# EAGLE schematic specMech - Copy (EAGLE 9.6.2)

## Sheet 1 of 8: Curiosity Nano
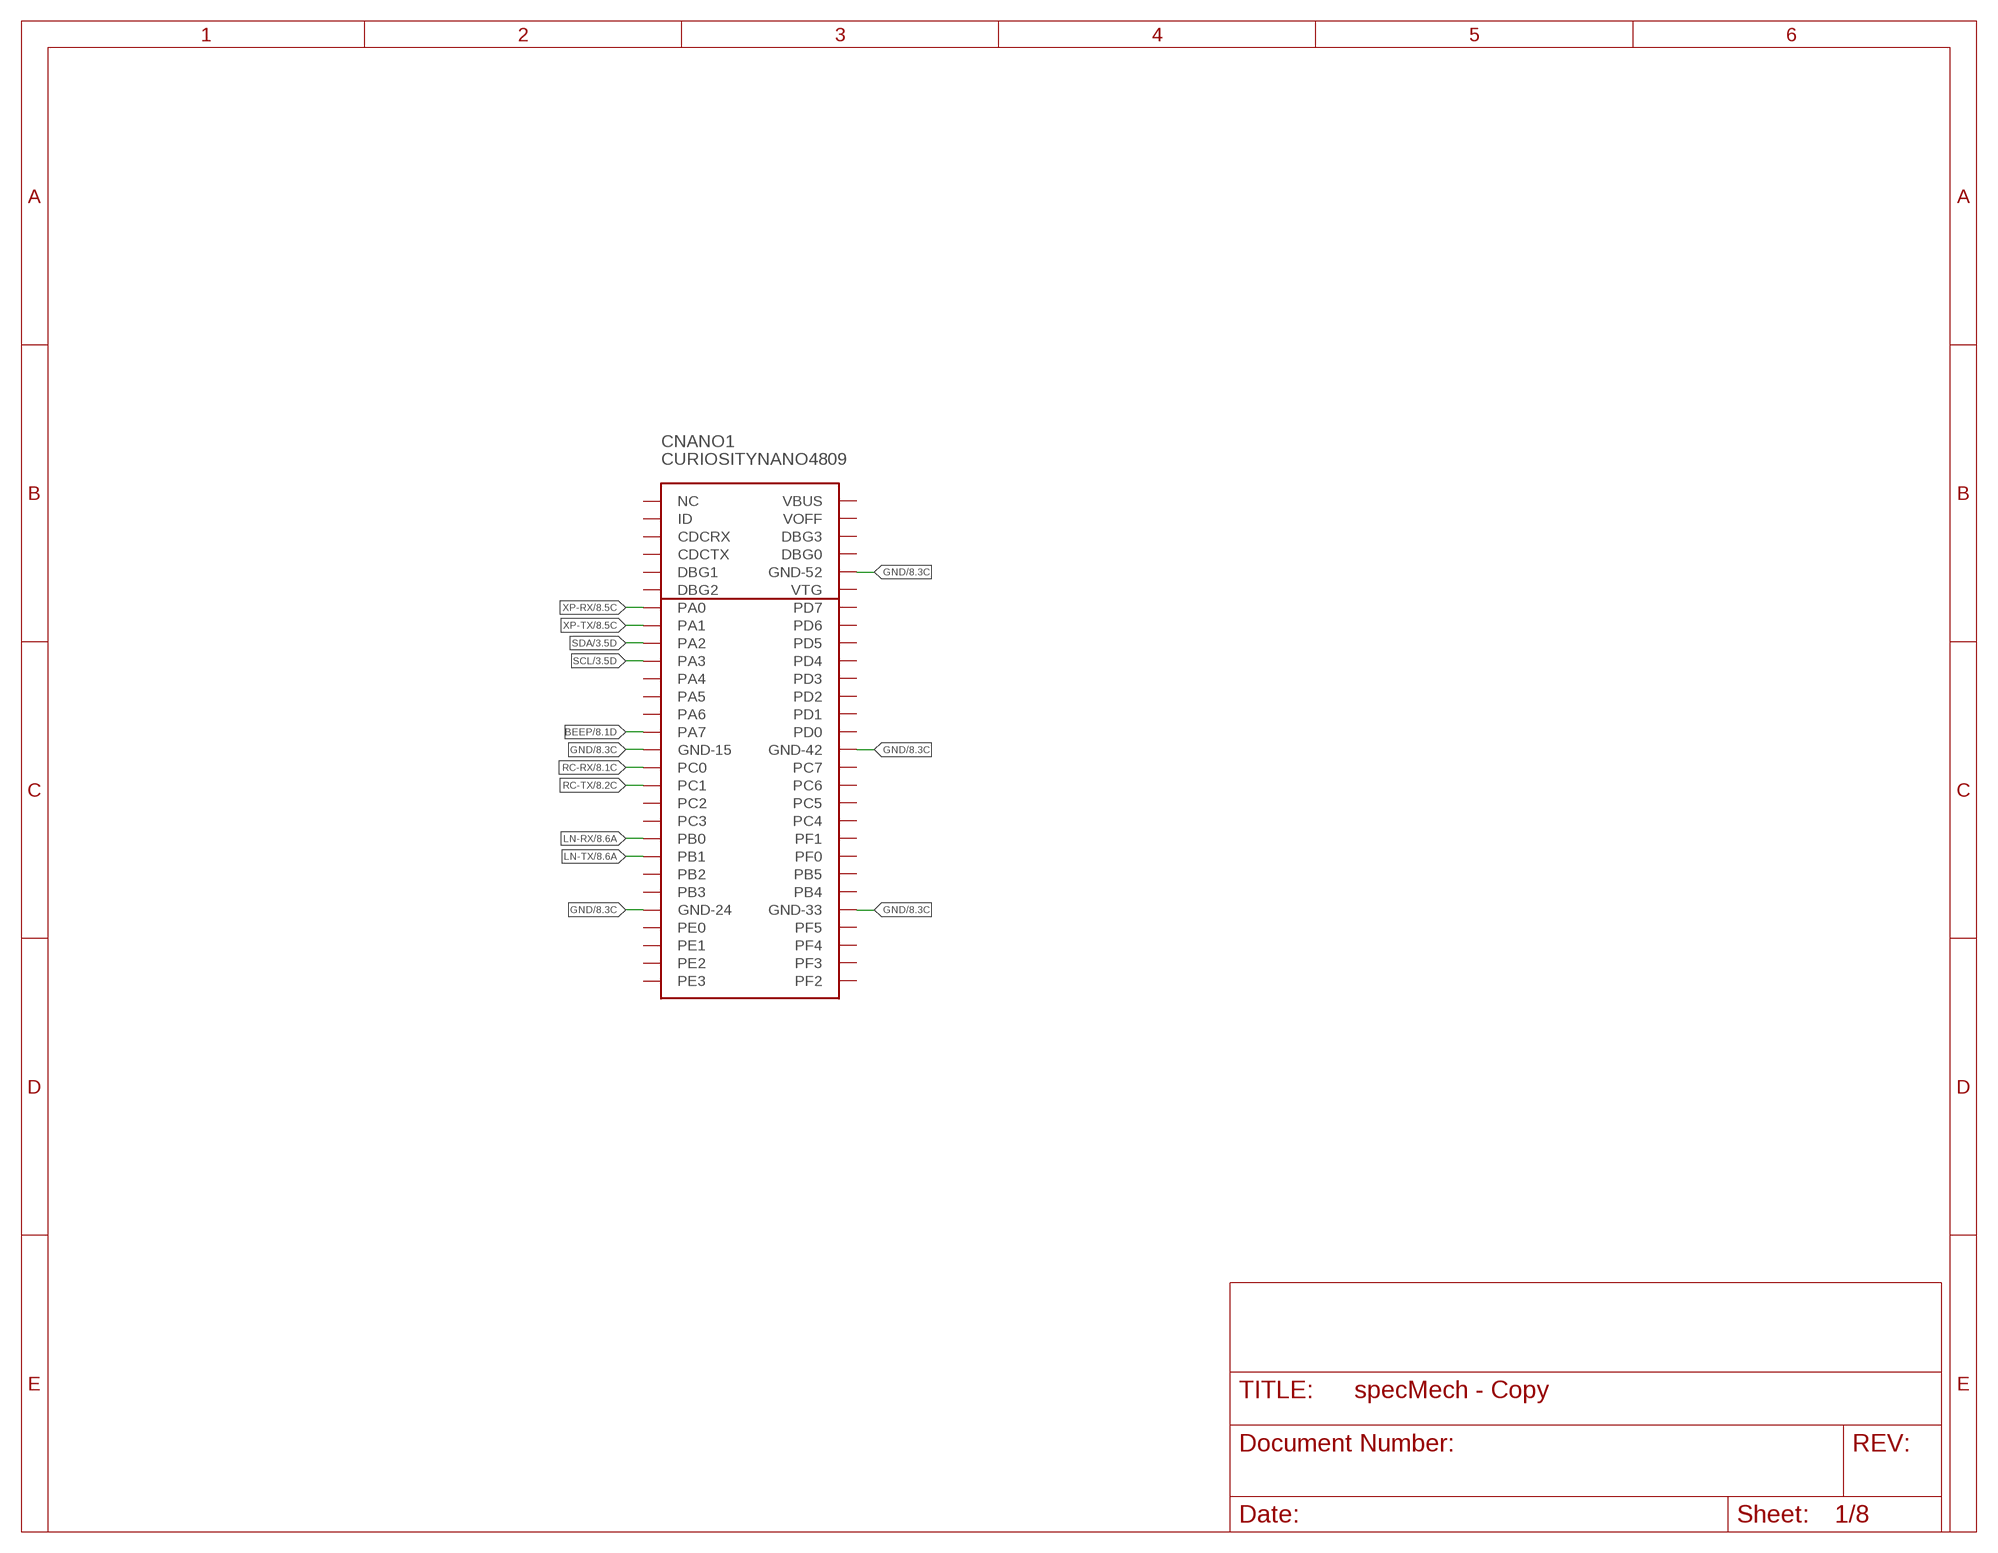
[diagram p0: schematic, sheet 1]

### Parts
CNANO1  CURIOSITYNANO4809  [CURIOSITYNANO4809]

### Nets
BEEP: CNANO1.PA7-SS(PA7) ; also sheet 8
GND: CNANO1.GND15(GND-15) CNANO1.GND24(GND-24) CNANO1.GND33(GND-33) CNANO1.GND42(GND-42) CNANO1.GND52(GND-52) ; also sheet 2,3,4,5,6,7,8
LN-RX: CNANO1.PB0-TX(PB0) ; also sheet 8
LN-TX: CNANO1.PB1-RX(PB1) ; also sheet 8
RC-RX: CNANO1.PC0-TX(PC0) ; also sheet 8
RC-TX: CNANO1.PC1-RX(PC1) ; also sheet 8
SCL: CNANO1.PA3-SCL(PA3) ; also sheet 3,4,5,6,7,8
SDA: CNANO1.PA2-SDA(PA2) ; also sheet 3,4,5,6,7,8
XP-RX: CNANO1.PA0-TX(PA0) ; also sheet 8
XP-TX: CNANO1.PA1-RX(PA1) ; also sheet 8
Unconnected: CNANO1.ID CNANO1.NC CNANO1.PA4-MOSI(PA4) CNANO1.PA5-MISO(PA5) CNANO1.PA6-SCK(PA6) CNANO1.PB0-RX(CDCRX) CNANO1.PB1-TX(CDCTX) CNANO1.PB2 CNANO1.PB3 CNANO1.PB4 CNANO1.PB5 CNANO1.PC2 CNANO1.PC3 CNANO1.PC4 CNANO1.PC5 CNANO1.PC6 CNANO1.PC7 CNANO1.PD0-AIN0(PD0) CNANO1.PD1-AIN1(PD1) CNANO1.PD2-AIN2(PD2) CNANO1.PD3-AIN3(PD3) CNANO1.PD4-AIN4(PD4) CNANO1.PD5-AIN5(PD5) CNANO1.PD6-AIN6(PD6) CNANO1.PD7-AIN7(PD7) CNANO1.PE0 CNANO1.PE1 CNANO1.PE2 CNANO1.PE3 CNANO1.PF0-TOSC1(PF0) CNANO1.PF1-TOSC2(PF1) CNANO1.PF2 CNANO1.PF2-6(DBG2) CNANO1.PF3 CNANO1.PF3-5(DBG1) CNANO1.PF4 CNANO1.PF5-LED(PF5) CNANO1.PF6-SW0(DBG3) CNANO1.UPDI(DBG0) CNANO1.VBUS CNANO1.VOFF CNANO1.VTG

## Sheet 2 of 8: +5V Power
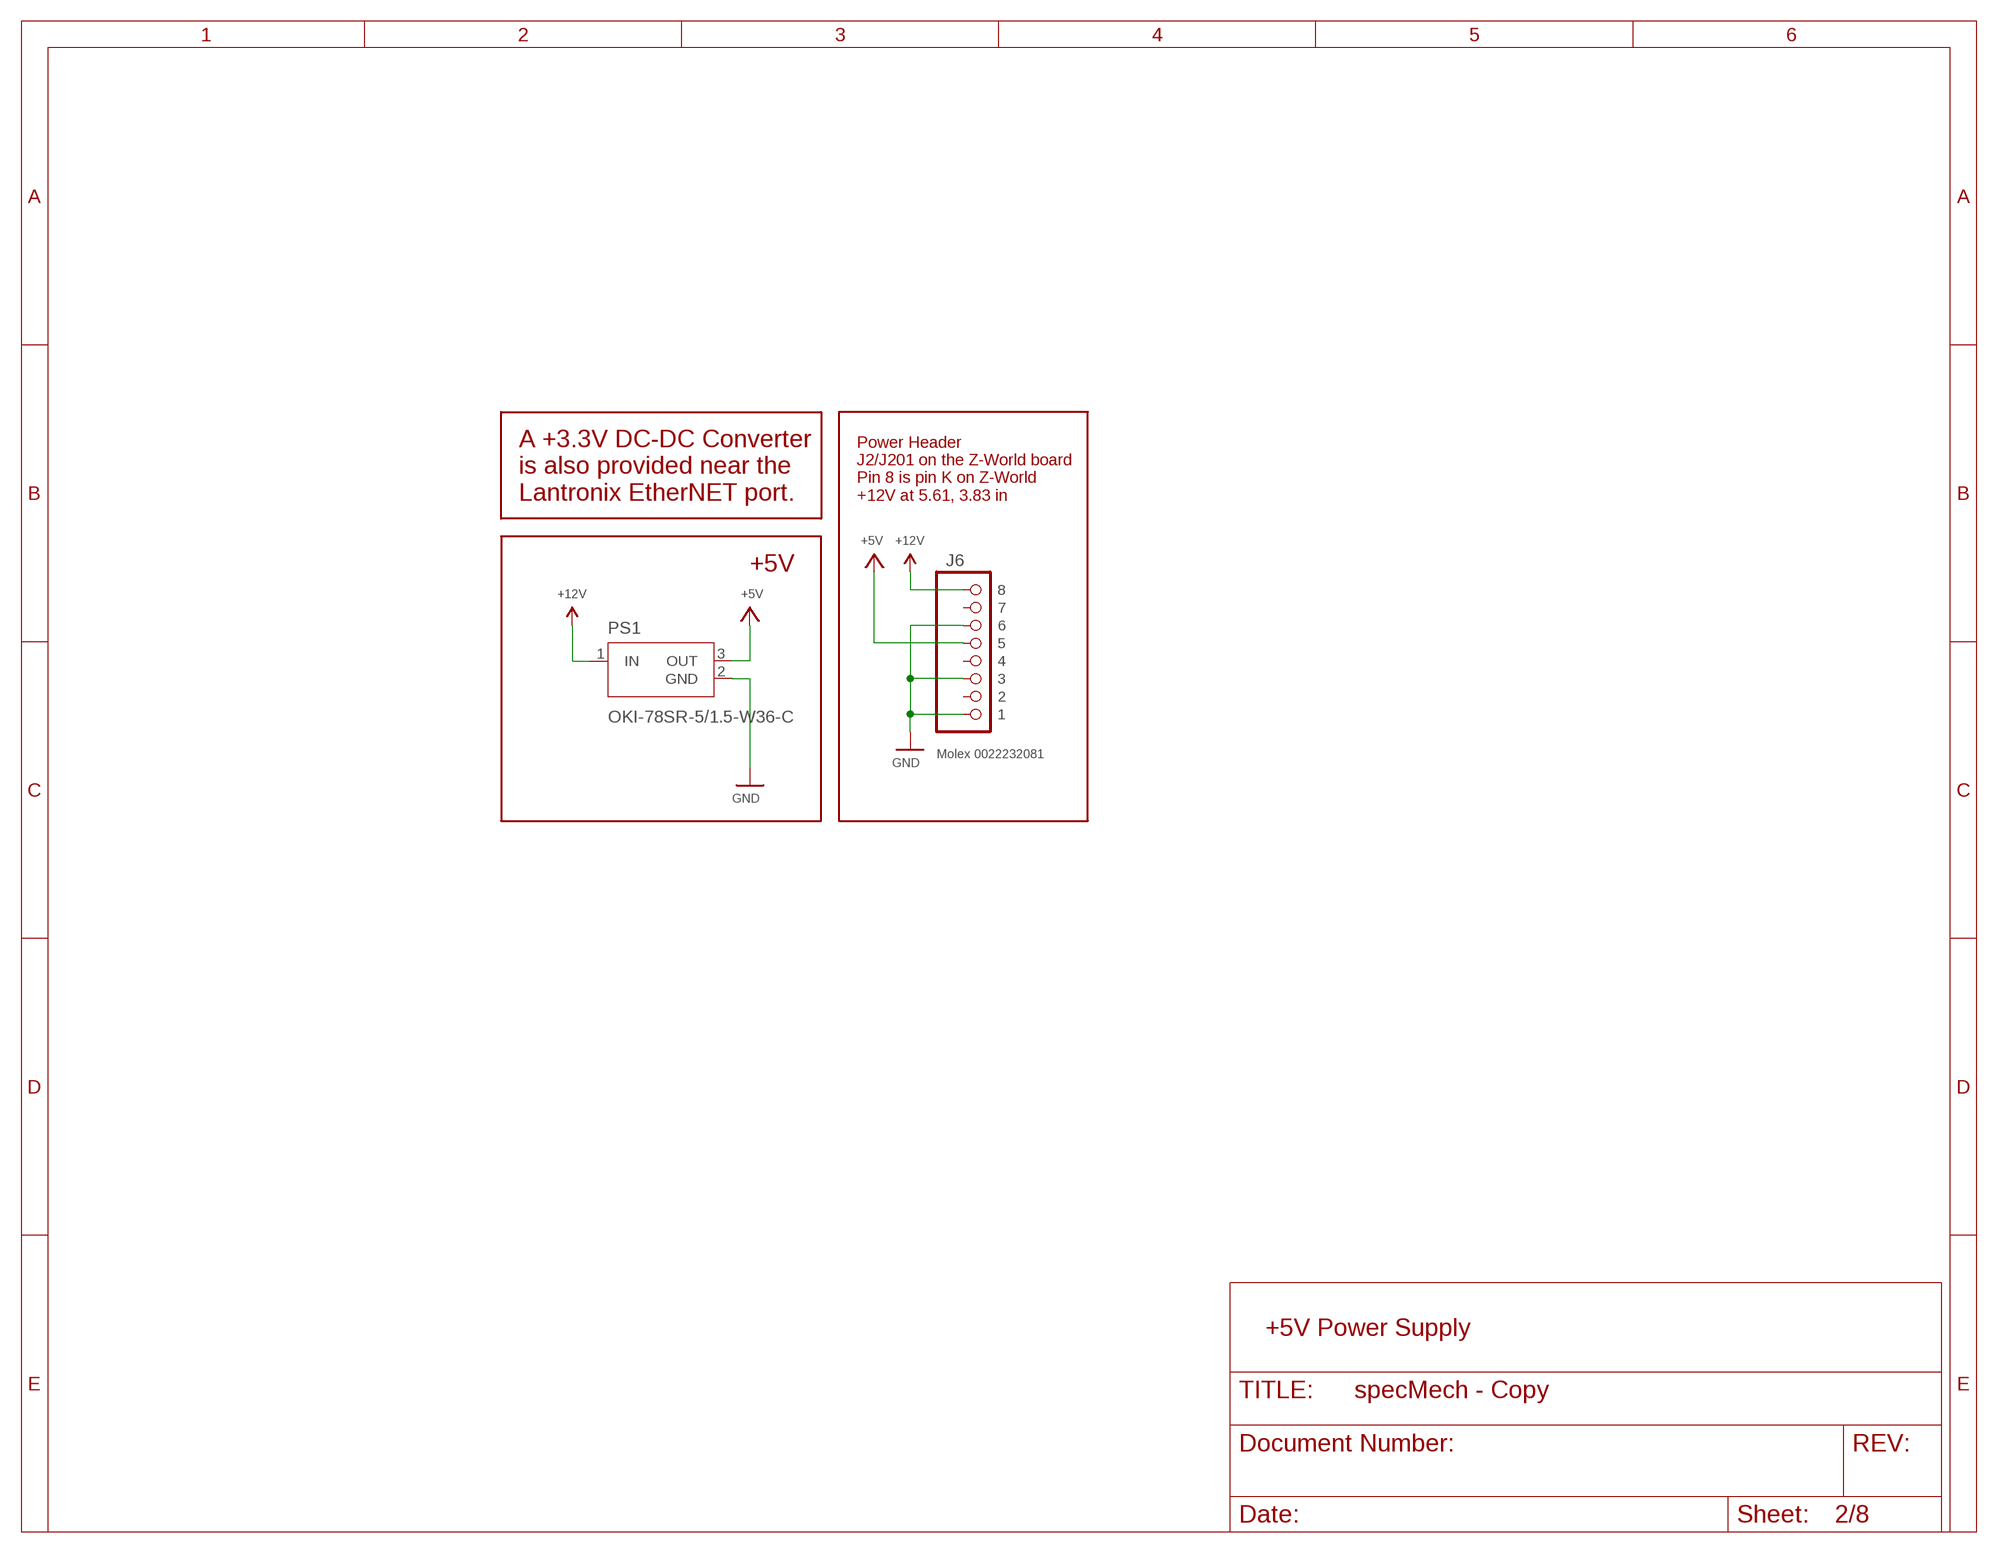
[diagram p1: schematic, sheet 2]

### Parts
J6  Molex 0022232081  PINHD-1X8-MOLEX-SHROUD  [1X08-MOLEX-SHROUD]
PS1  OKI-78SR-5/1.5-W36-C  [CONV_OKI-78SR-5/1.5-W36-C]

### Nets
+5V: J6.P$5 PS1.3(OUT) ; also sheet 3,4,5,6,7,8
+12V: J6.P$8 PS1.1(IN) ; also sheet 5,8
GND: J6.P$1 J6.P$3 J6.P$6 PS1.2(GND) ; also sheet 1,3,4,5,6,7,8
Unconnected: J6.P$2 J6.P$4 J6.P$7

### Notes on the sheet
- A +3.3V DC-DC Converter
  is also provided near the
  Lantronix EtherNET port.
- Power Header
  J2/J201 on the Z-World board
  Pin 8 is pin K on Z-World
  +12V at 5.61, 3.83 in
- +5V
- +5V Power Supply

## Sheet 3 of 8: Miscellaneous peripherals
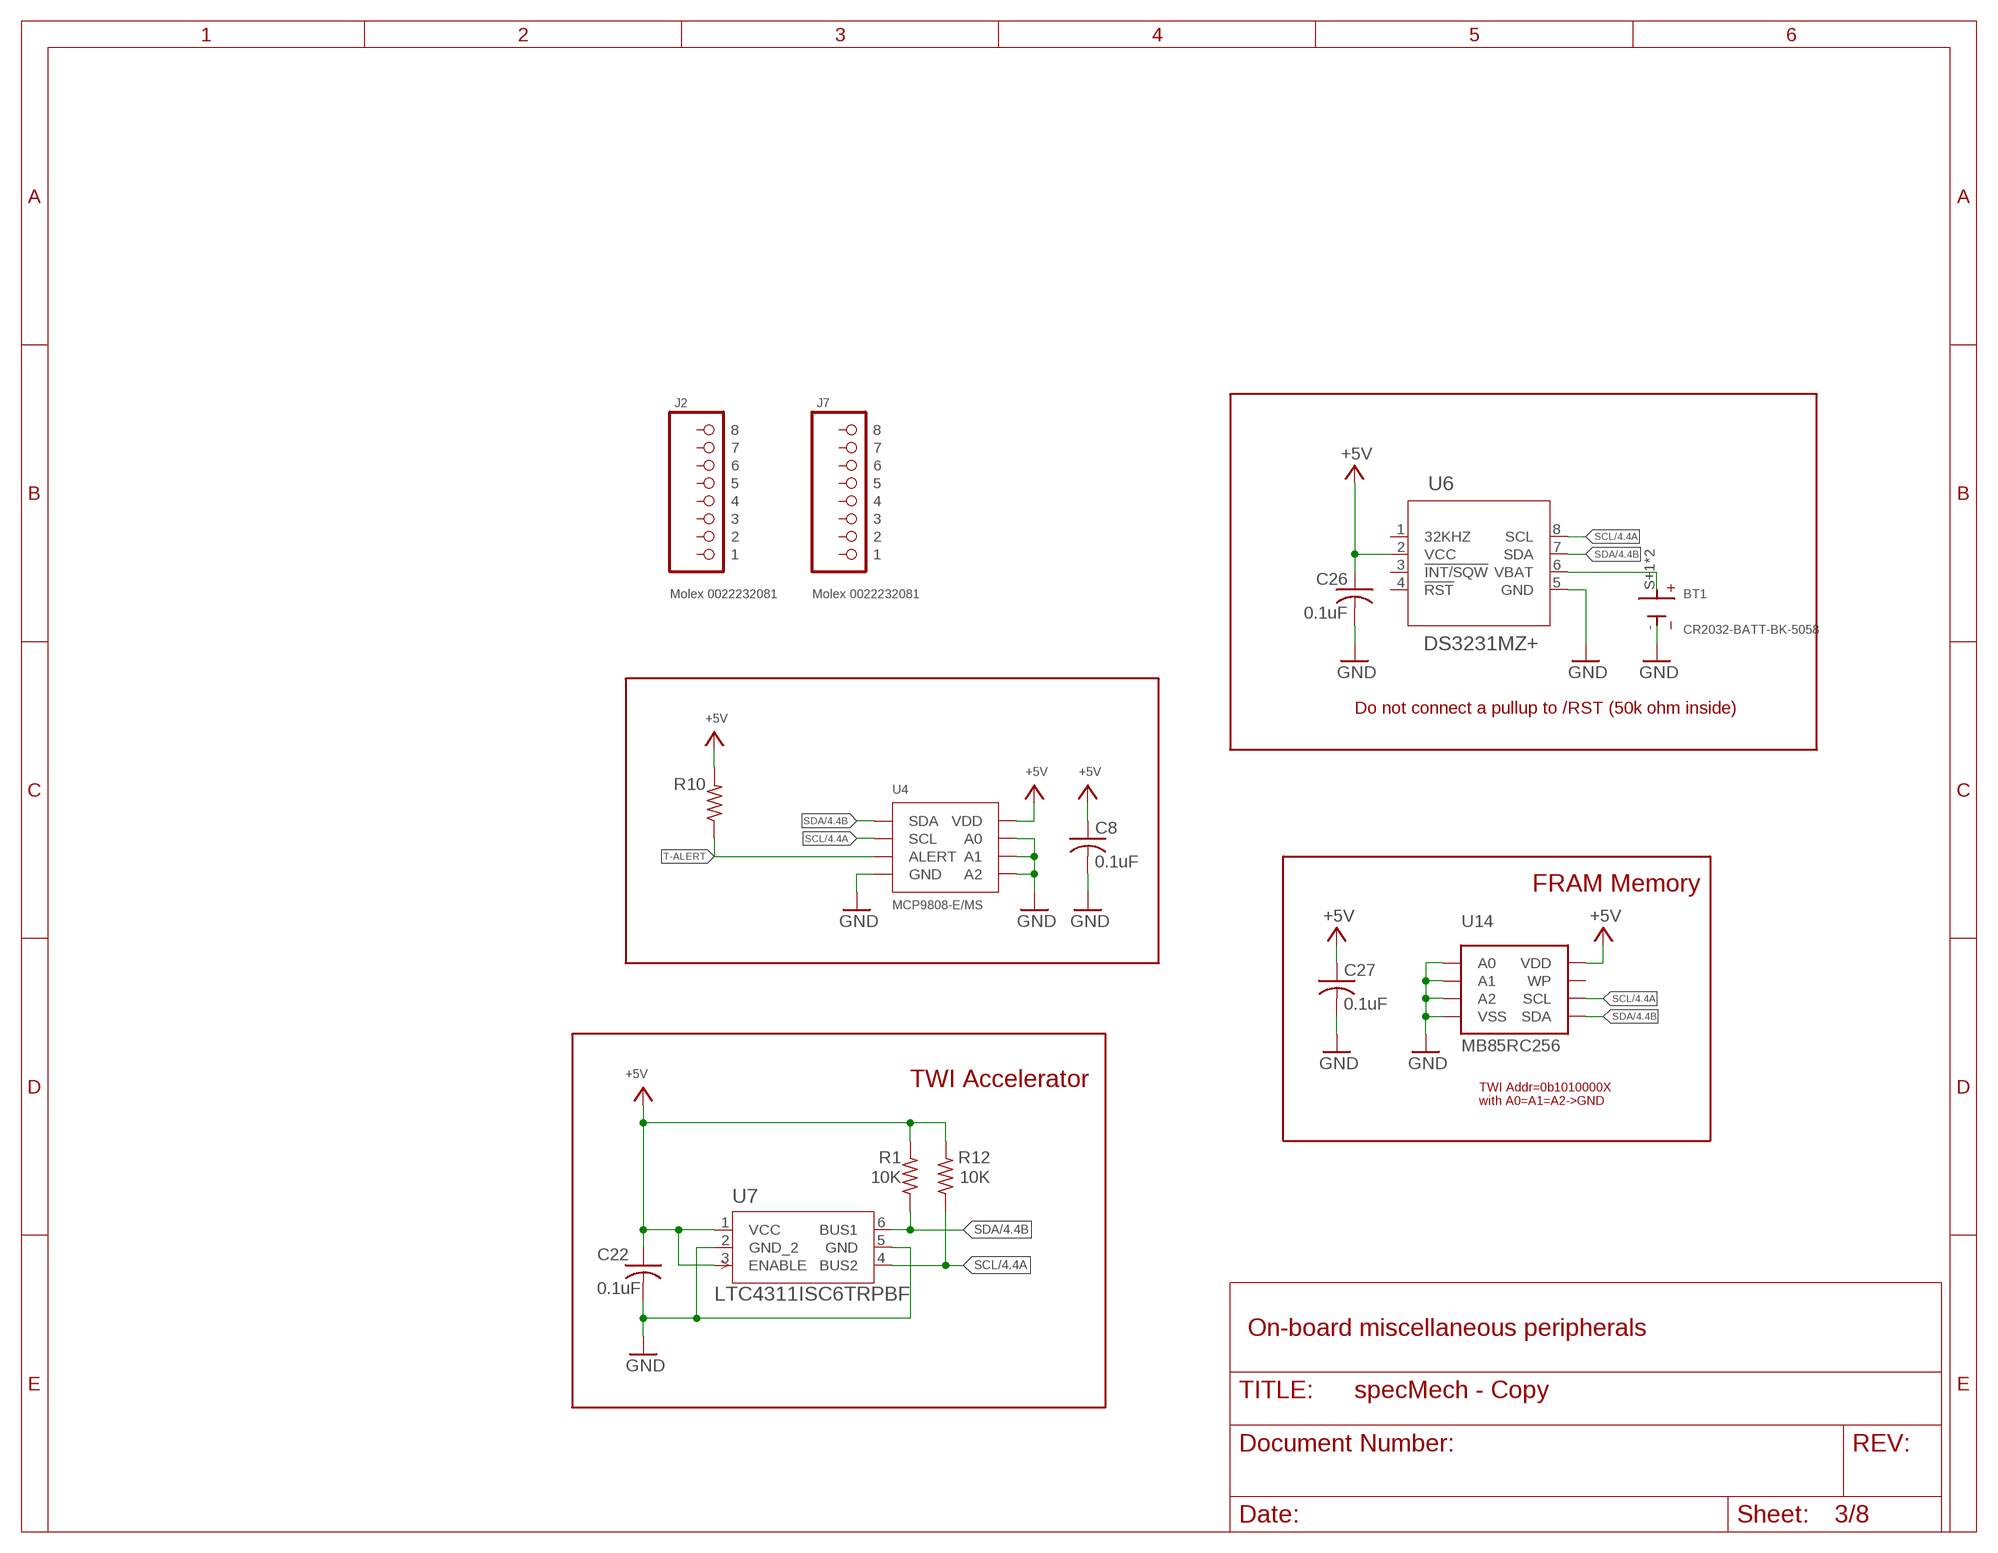
[diagram p2: schematic, sheet 3]

### Parts
BT1  CR2032-BATT-BK-5058  [BAT_BK-5058]
C8  0.1uF  C-USC0805  [C0805]
C22  0.1uF  C-USC0805  [C0805]
C26  0.1uF  C-USC0805  [C0805]
C27  0.1uF  C-USC0805  [C0805]
J2  Molex 0022232081  PINHD-1X8-MOLEX-SHROUD  [1X08-MOLEX-SHROUD]
J7  Molex 0022232081  PINHD-1X8-MOLEX-SHROUD  [1X08-MOLEX-SHROUD]
R1  10K  R-US_R0805  [R0805]
R10  R-US_R0805  [R0805]
R12  10K  R-US_R0805  [R0805]
U4  MCP9808-E/MS  [MSOP8_MC_MCH]
U6  DS3231MZ+  [21-0041B_8]
U7  LTC4311ISC6TRPBF  [SOT-6_SC_LIT]
U14  MB85RC256  MB85RC512  [SOIC127P600X175-8]

### Nets
+5V: C8.1 C22.1 C26.1 C27.1 R1.2 R10.2 R12.2 U4.8(VDD) U6.2(VCC) U7.1(VCC) U7.3(ENABLE) U14.8(VDD) ; also sheet 2,4,5,6,7,8
GND: BT1.- C8.2 C22.2 C26.2 C27.2 U4.4(GND) U4.5(A2) U4.6(A1) U4.7(A0) U6.5(GND) U7.2(GND_2) U7.5(GND) U14.1(A0) U14.2(A1) U14.3(A2) U14.4(VSS) ; also sheet 1,2,4,5,6,7,8
SCL: R12.1 U4.2(SCL) U6.8(SCL) U7.4(BUS2) U14.6(SCL) ; also sheet 1,4,5,6,7,8
SDA: R1.1 U4.1(SDA) U6.7(SDA) U7.6(BUS1) U14.5(SDA) ; also sheet 1,4,5,6,7,8
T-ALERT: R10.1 U4.3(ALERT)
VBAT1: BT1.S+1(+) BT1.S+2(+) U6.6(VBAT)
Unconnected: J2.P$1 J2.P$2 J2.P$3 J2.P$4 J2.P$5 J2.P$6 J2.P$7 J2.P$8 J7.P$1 J7.P$2 J7.P$3 J7.P$4 J7.P$5 J7.P$6 J7.P$7 J7.P$8 U6.1(32KHZ) U6.3(!INT/SQW) U6.4(!RST) U14.7(WP)

### Notes on the sheet
- Do not connect a pullup to /RST (50k ohm inside)
- FRAM Memory
- TWI Accelerator
- TWI Addr=0b1010000X
  with A0=A1=A2->GND
- On-board miscellaneous peripherals

## Sheet 4 of 8: Digital Input Port Expander
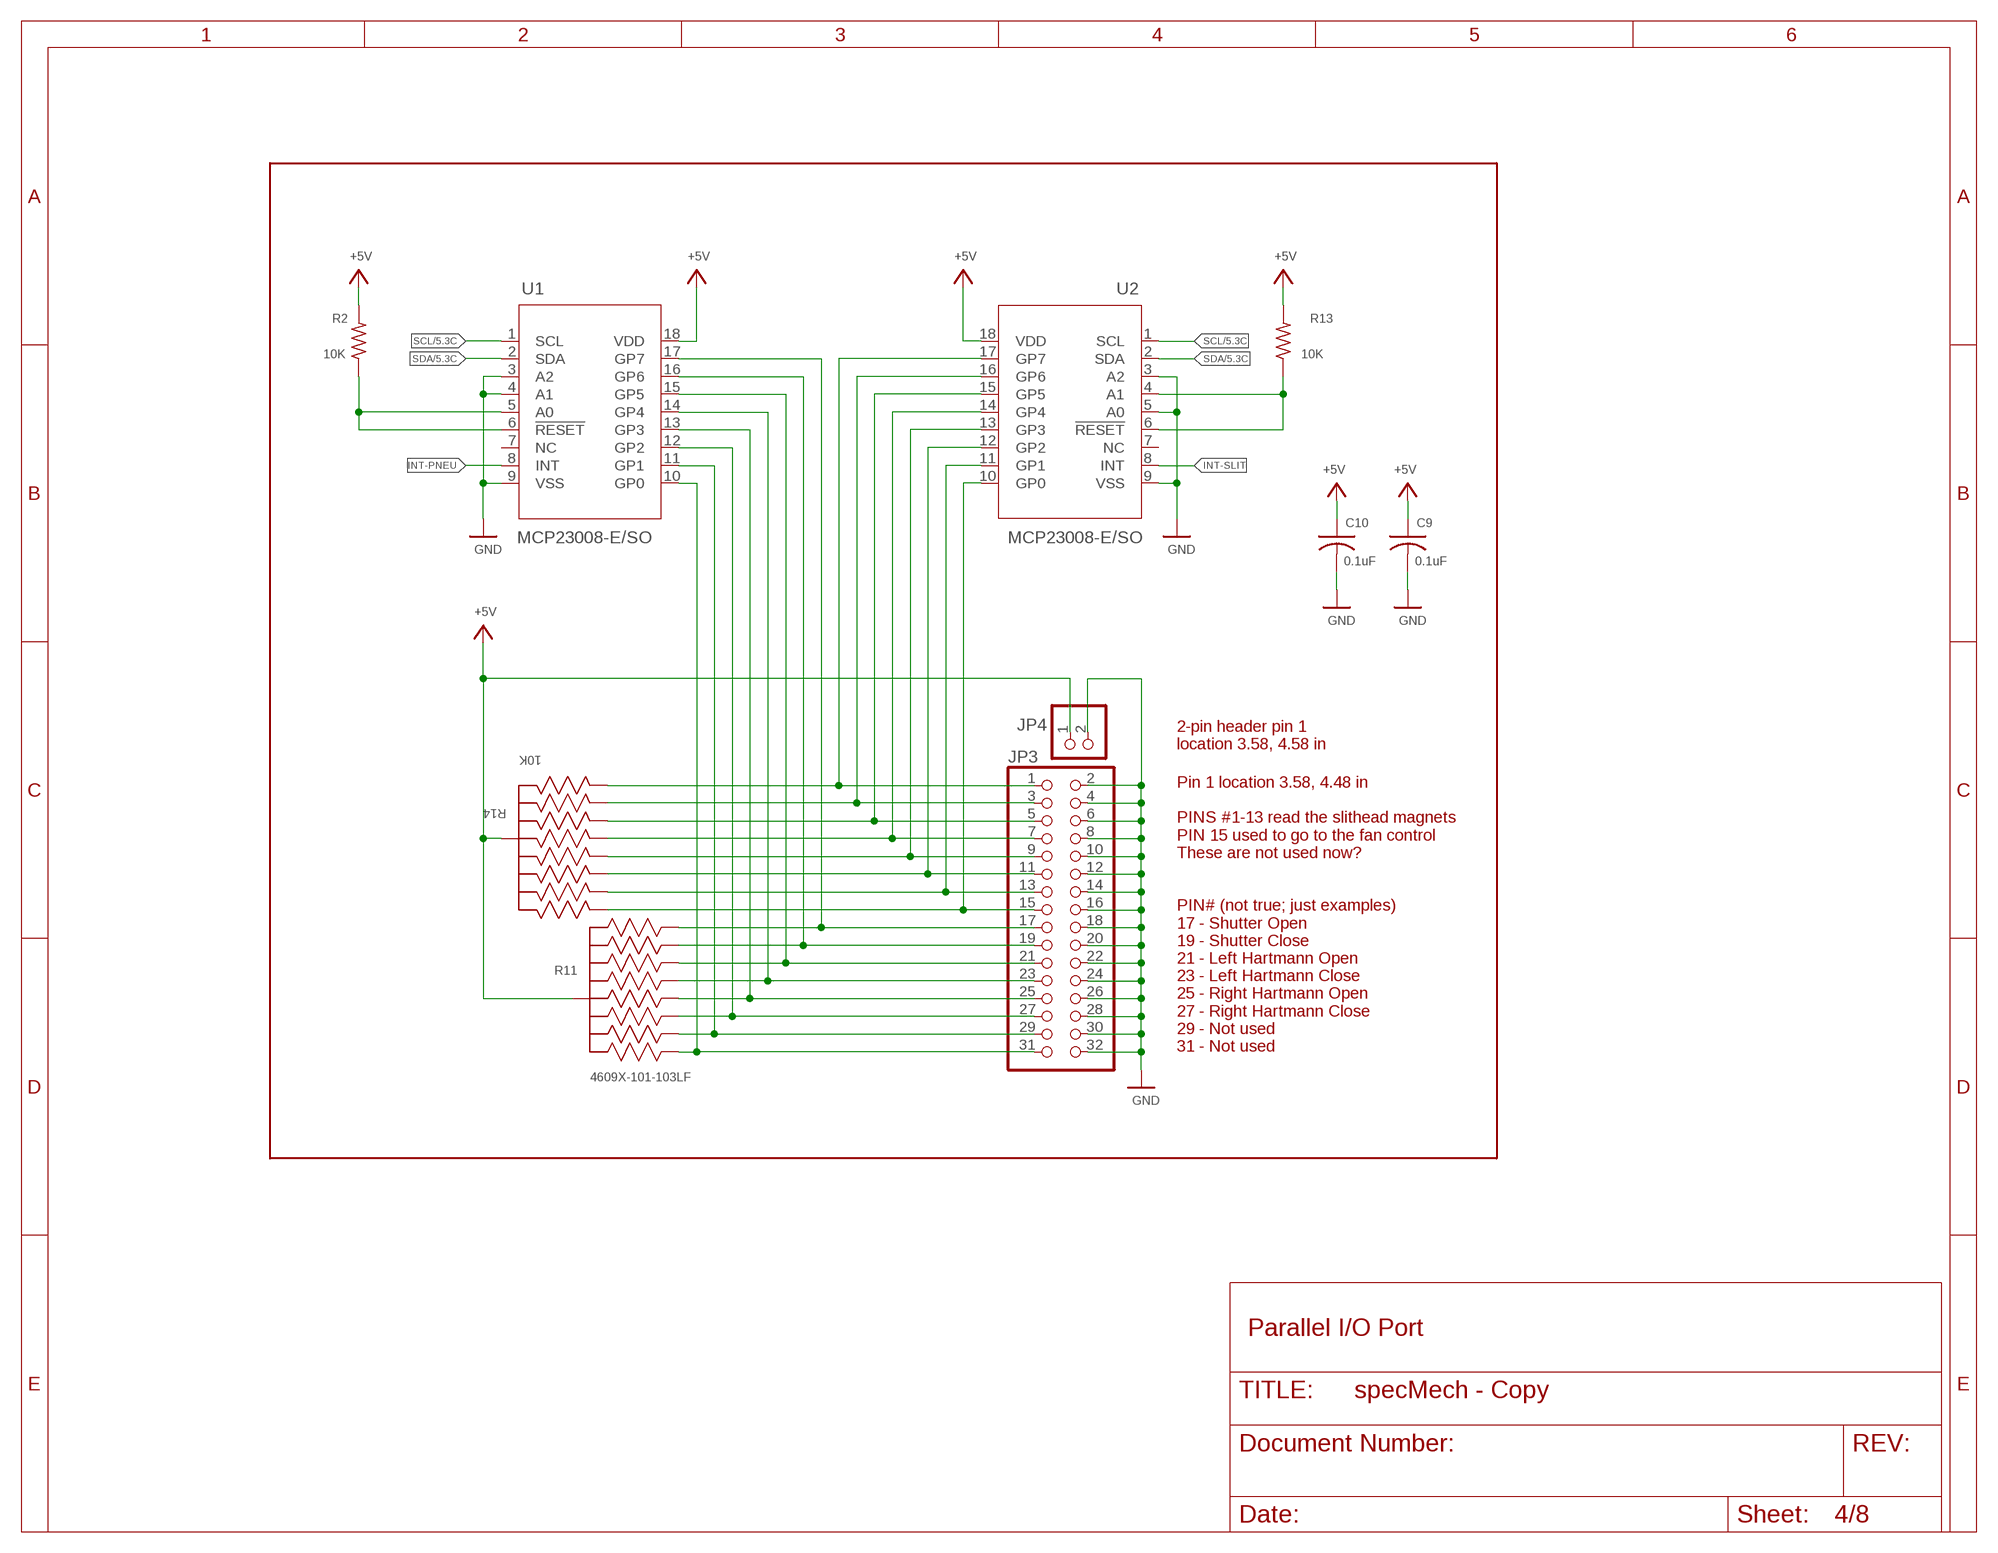
[diagram p3: schematic, sheet 4]

### Parts
C9  0.1uF  C-USC0805  [C0805]
C10  0.1uF  C-USC0805  [C0805]
JP3  PINHD-2X16  [2X16]
JP4  PINHD-1X2  [1X02]
R2  10K  R-US_R0805  [R0805]
R11  4609X-101-103LF  [BO_4609X]
R13  10K  R-US_R0805  [R0805]
R14  10K  4609X-101-103LF  [BO_4609X]
U1  MCP23008-E/SO  [SOIC18-W_MC]
U2  MCP23008-E/SO  [SOIC18-W_MC]

### Nets
+5V: C9.1 C10.1 JP4.1 R2.2 R11.1 R13.2 R14.1 U1.18(VDD) U2.18(VDD) ; also sheet 2,3,5,6,7,8
GND: C9.2 C10.2 JP3.2 JP3.4 JP3.6 JP3.8 JP3.10 JP3.12 JP3.14 JP3.16 JP3.18 JP3.20 JP3.22 JP3.24 JP3.26 JP3.28 JP3.30 JP3.32 JP4.2 U1.3(A2) U1.4(A1) U1.9(VSS) U2.3(A2) U2.5(A0) U2.9(VSS) ; also sheet 1,2,3,5,6,7,8
INT-PNEU: U1.8(INT)
INT-SLIT: U2.8(INT)
N$1: JP3.1 R14.2 U2.17(GP7)
N$2: JP3.3 R14.3 U2.16(GP6)
N$3: JP3.5 R14.4 U2.15(GP5)
N$4: JP3.7 R14.5 U2.14(GP4)
N$9: JP3.17 R11.9 U1.17(GP7)
N$10: JP3.19 R11.8 U1.16(GP6)
N$11: JP3.21 R11.7 U1.15(GP5)
N$12: JP3.23 R11.6 U1.14(GP4)
N$13: JP3.25 R11.5 U1.13(GP3)
N$14: R2.1 U1.5(A0) U1.6(!RESET)
N$15: JP3.29 R11.3 U1.11(GP1)
N$16: JP3.31 R11.2 U1.10(GP0)
N$17: JP3.11 R14.7 U2.12(GP2)
N$20: JP3.27 R11.4 U1.12(GP2)
N$21: JP3.13 R14.8 U2.11(GP1)
N$22: JP3.15 R14.9 U2.10(GP0)
N$24: R13.1 U2.4(A1) U2.6(!RESET)
N$36: JP3.9 R14.6 U2.13(GP3)
SCL: U1.1(SCL) U2.1(SCL) ; also sheet 1,3,5,6,7,8
SDA: U1.2(SDA) U2.2(SDA) ; also sheet 1,3,5,6,7,8
Unconnected: U1.7(NC) U2.7(NC)

### Notes on the sheet
- 2-pin header pin 1
  location 3.58, 4.58 in
- Pin 1 location 3.58, 4.48 in
  
  PINS #1-13 read the slithead magnets
  PIN 15 used to go to the fan control
  These are not used now?
  
  
  PIN# (not true; just examples)
  17 - Shutter Open
  19 - Shutter Close
  21 - Left Hartmann Open
  23 - Left Hartmann Close
  25 - Right Hartmann Open
  27 - Right Hartmann Close
  29 - Not used
  31 - Not used
- Parallel I/O Port

## Sheet 5 of 8: High Current Output
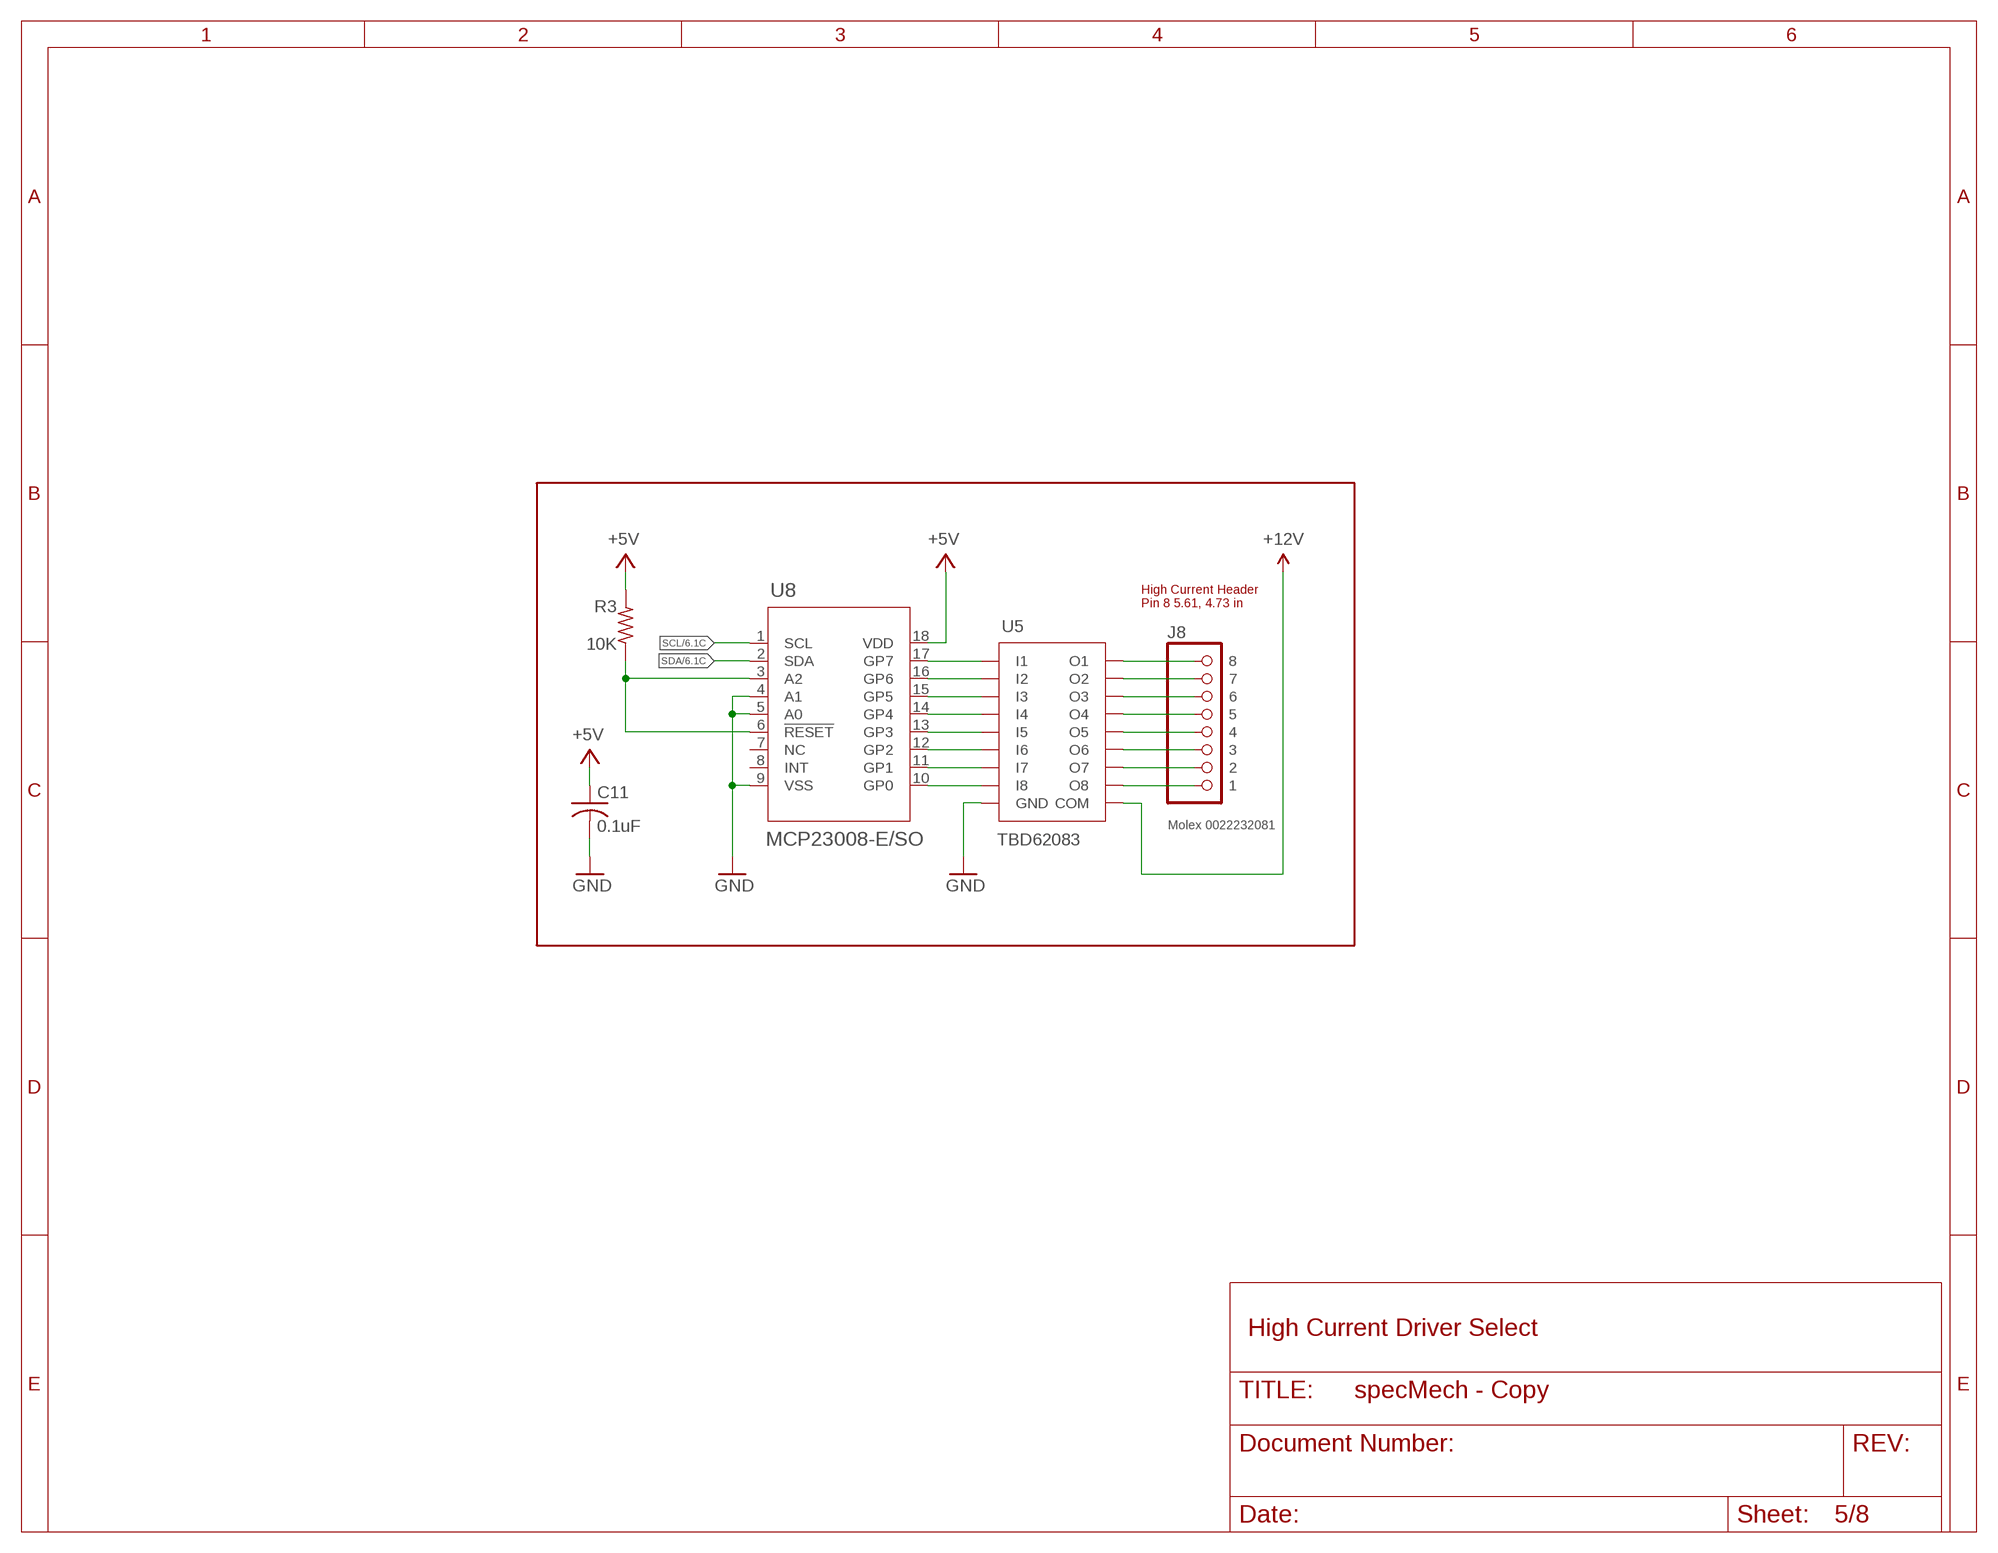
[diagram p4: schematic, sheet 5]

### Parts
C11  0.1uF  C-USC0805  [C0805]
J8  Molex 0022232081  PINHD-1X8-MOLEX-SHROUD  [1X08-MOLEX-SHROUD]
R3  10K  R-US_R0805  [R0805]
U5  TBD62083  TBD62083SOP18-P-375-1.27  [SOIC127P1030X245-18]
U8  MCP23008-E/SO  [SOIC18-W_MC]

### Nets
+5V: C11.1 R3.2 U8.18(VDD) ; also sheet 2,3,4,6,7,8
+12V: U5.10(COM) ; also sheet 2,8
GND: C11.2 U5.9(GND) U8.4(A1) U8.5(A0) U8.9(VSS) ; also sheet 1,2,3,4,6,7,8
N$37: U5.1(I1) U8.17(GP7)
N$38: U5.2(I2) U8.16(GP6)
N$39: U5.3(I3) U8.15(GP5)
N$44: U5.4(I4) U8.14(GP4)
N$45: U5.5(I5) U8.13(GP3)
N$46: U5.6(I6) U8.12(GP2)
N$47: U5.7(I7) U8.11(GP1)
N$48: U5.8(I8) U8.10(GP0)
N$49: R3.1 U8.3(A2) U8.6(!RESET)
N$50: J8.P$8 U5.18(O1)
N$51: J8.P$1 U5.11(O8)
N$52: J8.P$2 U5.12(O7)
N$53: J8.P$3 U5.13(O6)
N$54: J8.P$4 U5.14(O5)
N$55: J8.P$5 U5.15(O4)
N$56: J8.P$6 U5.16(O3)
N$57: J8.P$7 U5.17(O2)
SCL: U8.1(SCL) ; also sheet 1,3,4,6,7,8
SDA: U8.2(SDA) ; also sheet 1,3,4,6,7,8
Unconnected: U8.7(NC) U8.8(INT)

### Notes on the sheet
- High Current Header
  Pin 8 5.61, 4.73 in
- High Current Driver Select

## Sheet 6 of 8: Analog Inputs
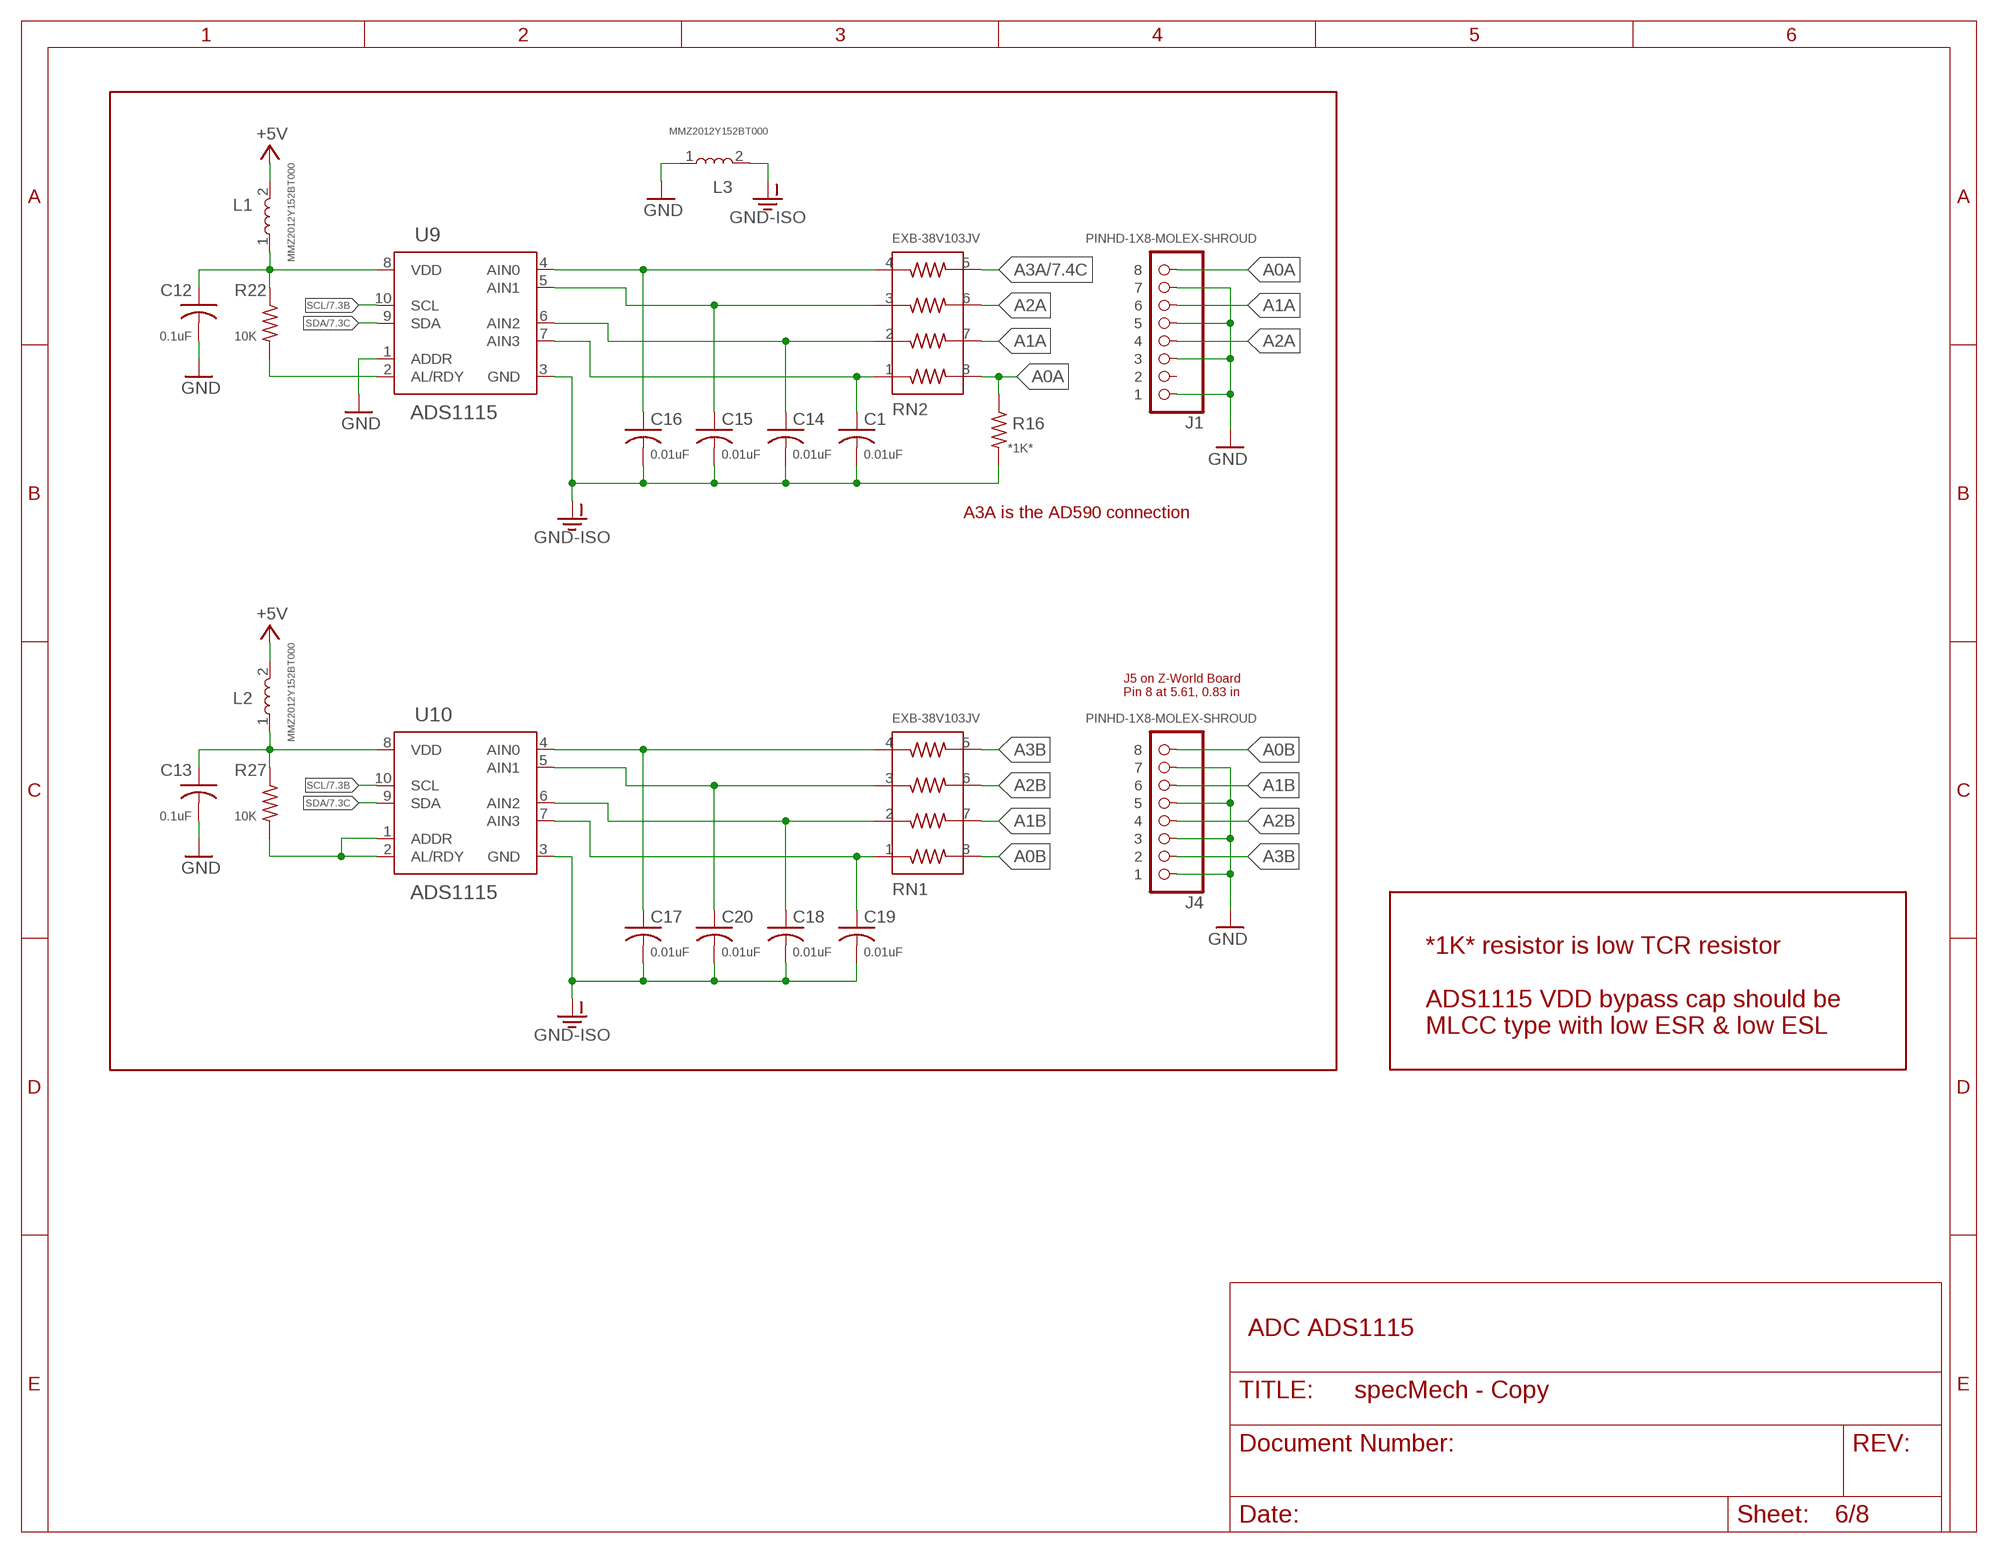
[diagram p5: schematic, sheet 6]

### Parts
C1  0.01uF  C-USC0805  [C0805]
C12  0.1uF  C-USC0805  [C0805]
C13  0.1uF  C-USC0805  [C0805]
C14  0.01uF  C-USC0805  [C0805]
C15  0.01uF  C-USC0805  [C0805]
C16  0.01uF  C-USC0805  [C0805]
C17  0.01uF  C-USC0805  [C0805]
C18  0.01uF  C-USC0805  [C0805]
C19  0.01uF  C-USC0805  [C0805]
C20  0.01uF  C-USC0805  [C0805]
J1  PINHD-1X8-MOLEX-SHROUD  [1X08-MOLEX-SHROUD]
J4  PINHD-1X8-MOLEX-SHROUD  [1X08-MOLEX-SHROUD]
L1  MMZ2012Y152BT000  [INDC2012X87N]
L2  MMZ2012Y152BT000  [INDC2012X87N]
L3  MMZ2012Y152BT000  [INDC2012X87N]
R16  *1K*  R-US_R0805  [R0805]
R22  10K  R-US_R0805  [R0805]
R27  10K  R-US_R0805  [R0805]
RN1  EXB-38V103JV  [EXB38V_PAN]
RN2  EXB-38V103JV  [EXB38V_PAN]
U9  ADS1115  ADS1115IDGSRVSSOP-10  [SOP50P490X110-10N]
U10  ADS1115  ADS1115IDGSRVSSOP-10  [SOP50P490X110-10N]

### Nets
+5V: L1.2 L2.2 ; also sheet 2,3,4,5,7,8
A0A: J1.P$8 R16.1 RN2.8
A0B: J4.P$8 RN1.8
A1A: J1.P$6 RN2.7
A1B: J4.P$6 RN1.7
A2A: J1.P$4 RN2.6
A2B: J4.P$4 RN1.6
A3A: C1.1 RN2.1 RN2.5 U9.7(AIN3) ; also sheet 7
A3B: J4.P$2 RN1.5
GND: C12.2 C13.2 J1.P$1 J1.P$3 J1.P$5 J1.P$7 J4.P$1 J4.P$3 J4.P$5 J4.P$7 L3.1 U9.1(ADDR) ; also sheet 1,2,3,4,5,7,8
GND-ISO: C1.2 C14.2 C15.2 C16.2 C17.2 C18.2 C19.2 C20.2 L3.2 R16.2 U9.3(GND) U10.3(GND)
N$6: C13.1 L2.1 R27.1 U10.8(VDD)
N$7: C12.1 L1.1 R22.1 U9.8(VDD)
N$62: C16.1 RN2.4 U9.4(AIN0)
N$63: C15.1 RN2.3 U9.5(AIN1)
N$64: R22.2 U9.2(AL/RDY)
N$65: C19.1 RN1.1 U10.7(AIN3)
N$66: C14.1 RN2.2 U9.6(AIN2)
N$67: C18.1 RN1.2 U10.6(AIN2)
N$68: C20.1 RN1.3 U10.5(AIN1)
N$69: C17.1 RN1.4 U10.4(AIN0)
N$70: R27.2 U10.1(ADDR) U10.2(AL/RDY)
SCL: U9.10(SCL) U10.10(SCL) ; also sheet 1,3,4,5,7,8
SDA: U9.9(SDA) U10.9(SDA) ; also sheet 1,3,4,5,7,8
Unconnected: J1.P$2

### Notes on the sheet
- A3A is the AD590 connection
- J5 on Z-World Board
  Pin 8 at 5.61, 0.83 in
- *1K* resistor is low TCR resistor
  
  ADS1115 VDD bypass cap should be
  MLCC type with low ESR & low ESL
- ADC ADS1115

## Sheet 7 of 8: AD590 Temp Sensor Selector
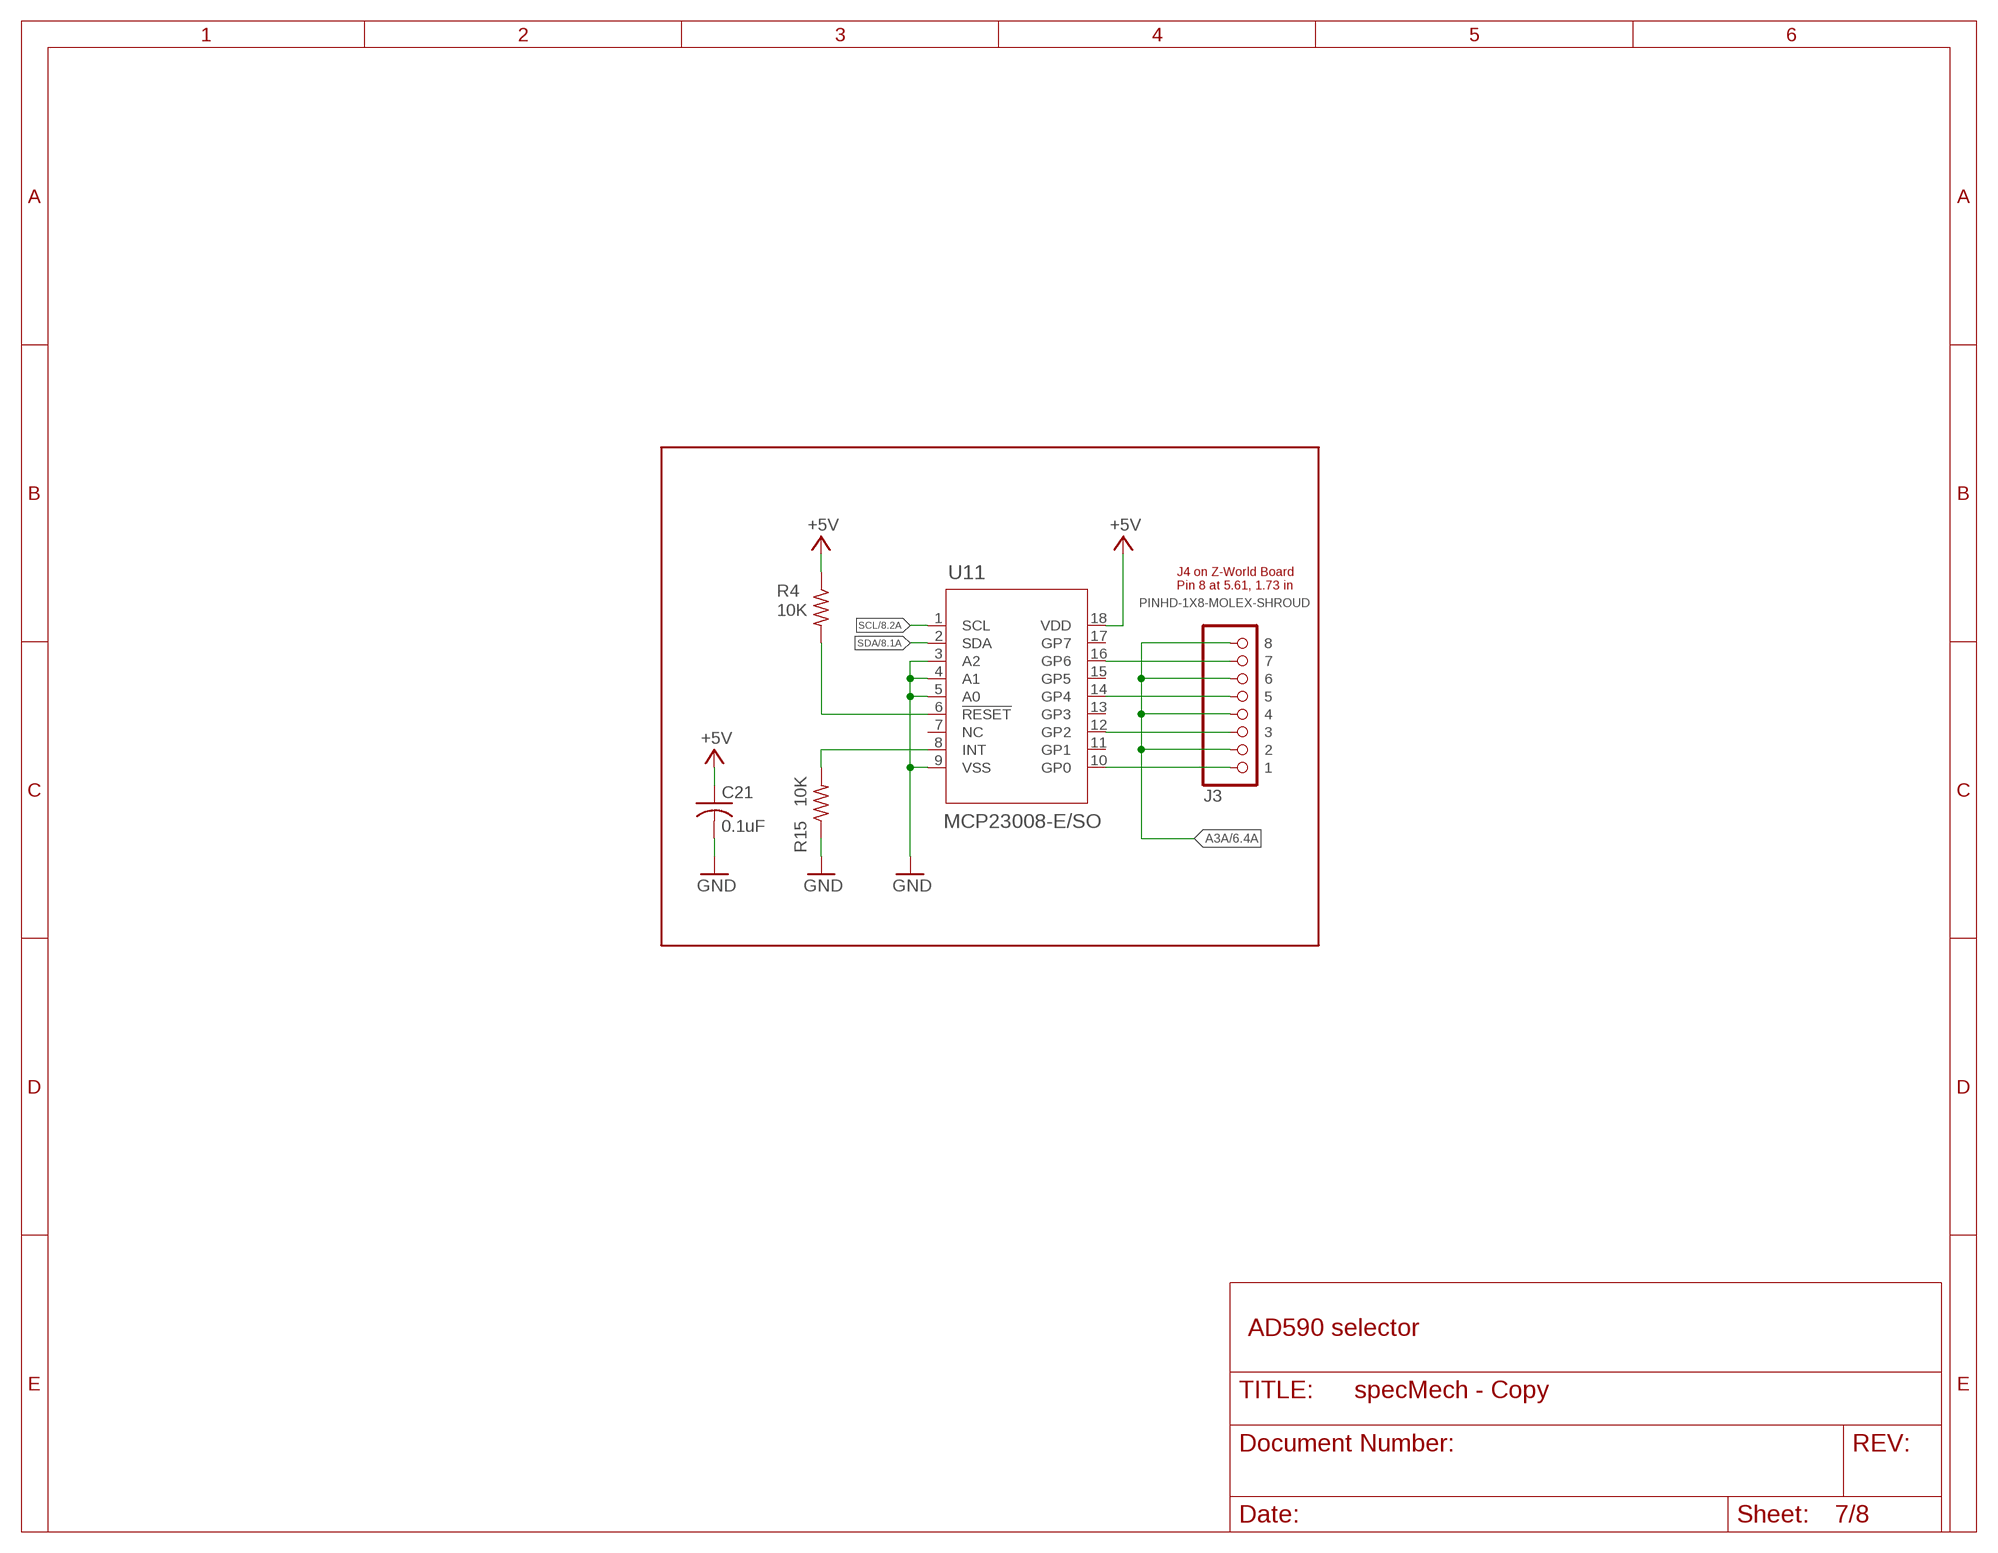
[diagram p6: schematic, sheet 7]

### Parts
C21  0.1uF  C-USC0805  [C0805]
J3  PINHD-1X8-MOLEX-SHROUD  [1X08-MOLEX-SHROUD]
R4  10K  R-US_R0805  [R0805]
R15  10K  R-US_R0805  [R0805]
U11  MCP23008-E/SO  [SOIC18-W_MC]

### Nets
+5V: C21.1 R4.1 U11.18(VDD) ; also sheet 2,3,4,5,6,8
A3A: J3.P$2 J3.P$4 J3.P$6 J3.P$8 ; also sheet 6
GND: C21.2 R15.1 U11.3(A2) U11.4(A1) U11.5(A0) U11.9(VSS) ; also sheet 1,2,3,4,5,6,8
N$5: R4.2 U11.6(!RESET)
N$18: R15.2 U11.8(INT)
N$60: J3.P$1 U11.10(GP0)
N$61: J3.P$3 U11.12(GP2)
N$71: J3.P$5 U11.14(GP4)
N$72: J3.P$7 U11.16(GP6)
SCL: U11.1(SCL) ; also sheet 1,3,4,5,6,8
SDA: U11.2(SDA) ; also sheet 1,3,4,5,6,8
Unconnected: U11.7(NC) U11.11(GP1) U11.13(GP3) U11.15(GP5) U11.17(GP7)

### Notes on the sheet
- J4 on Z-World Board
  Pin 8 at 5.61, 1.73 in
- AD590 selector

## Sheet 8 of 8: Off-board interfaces
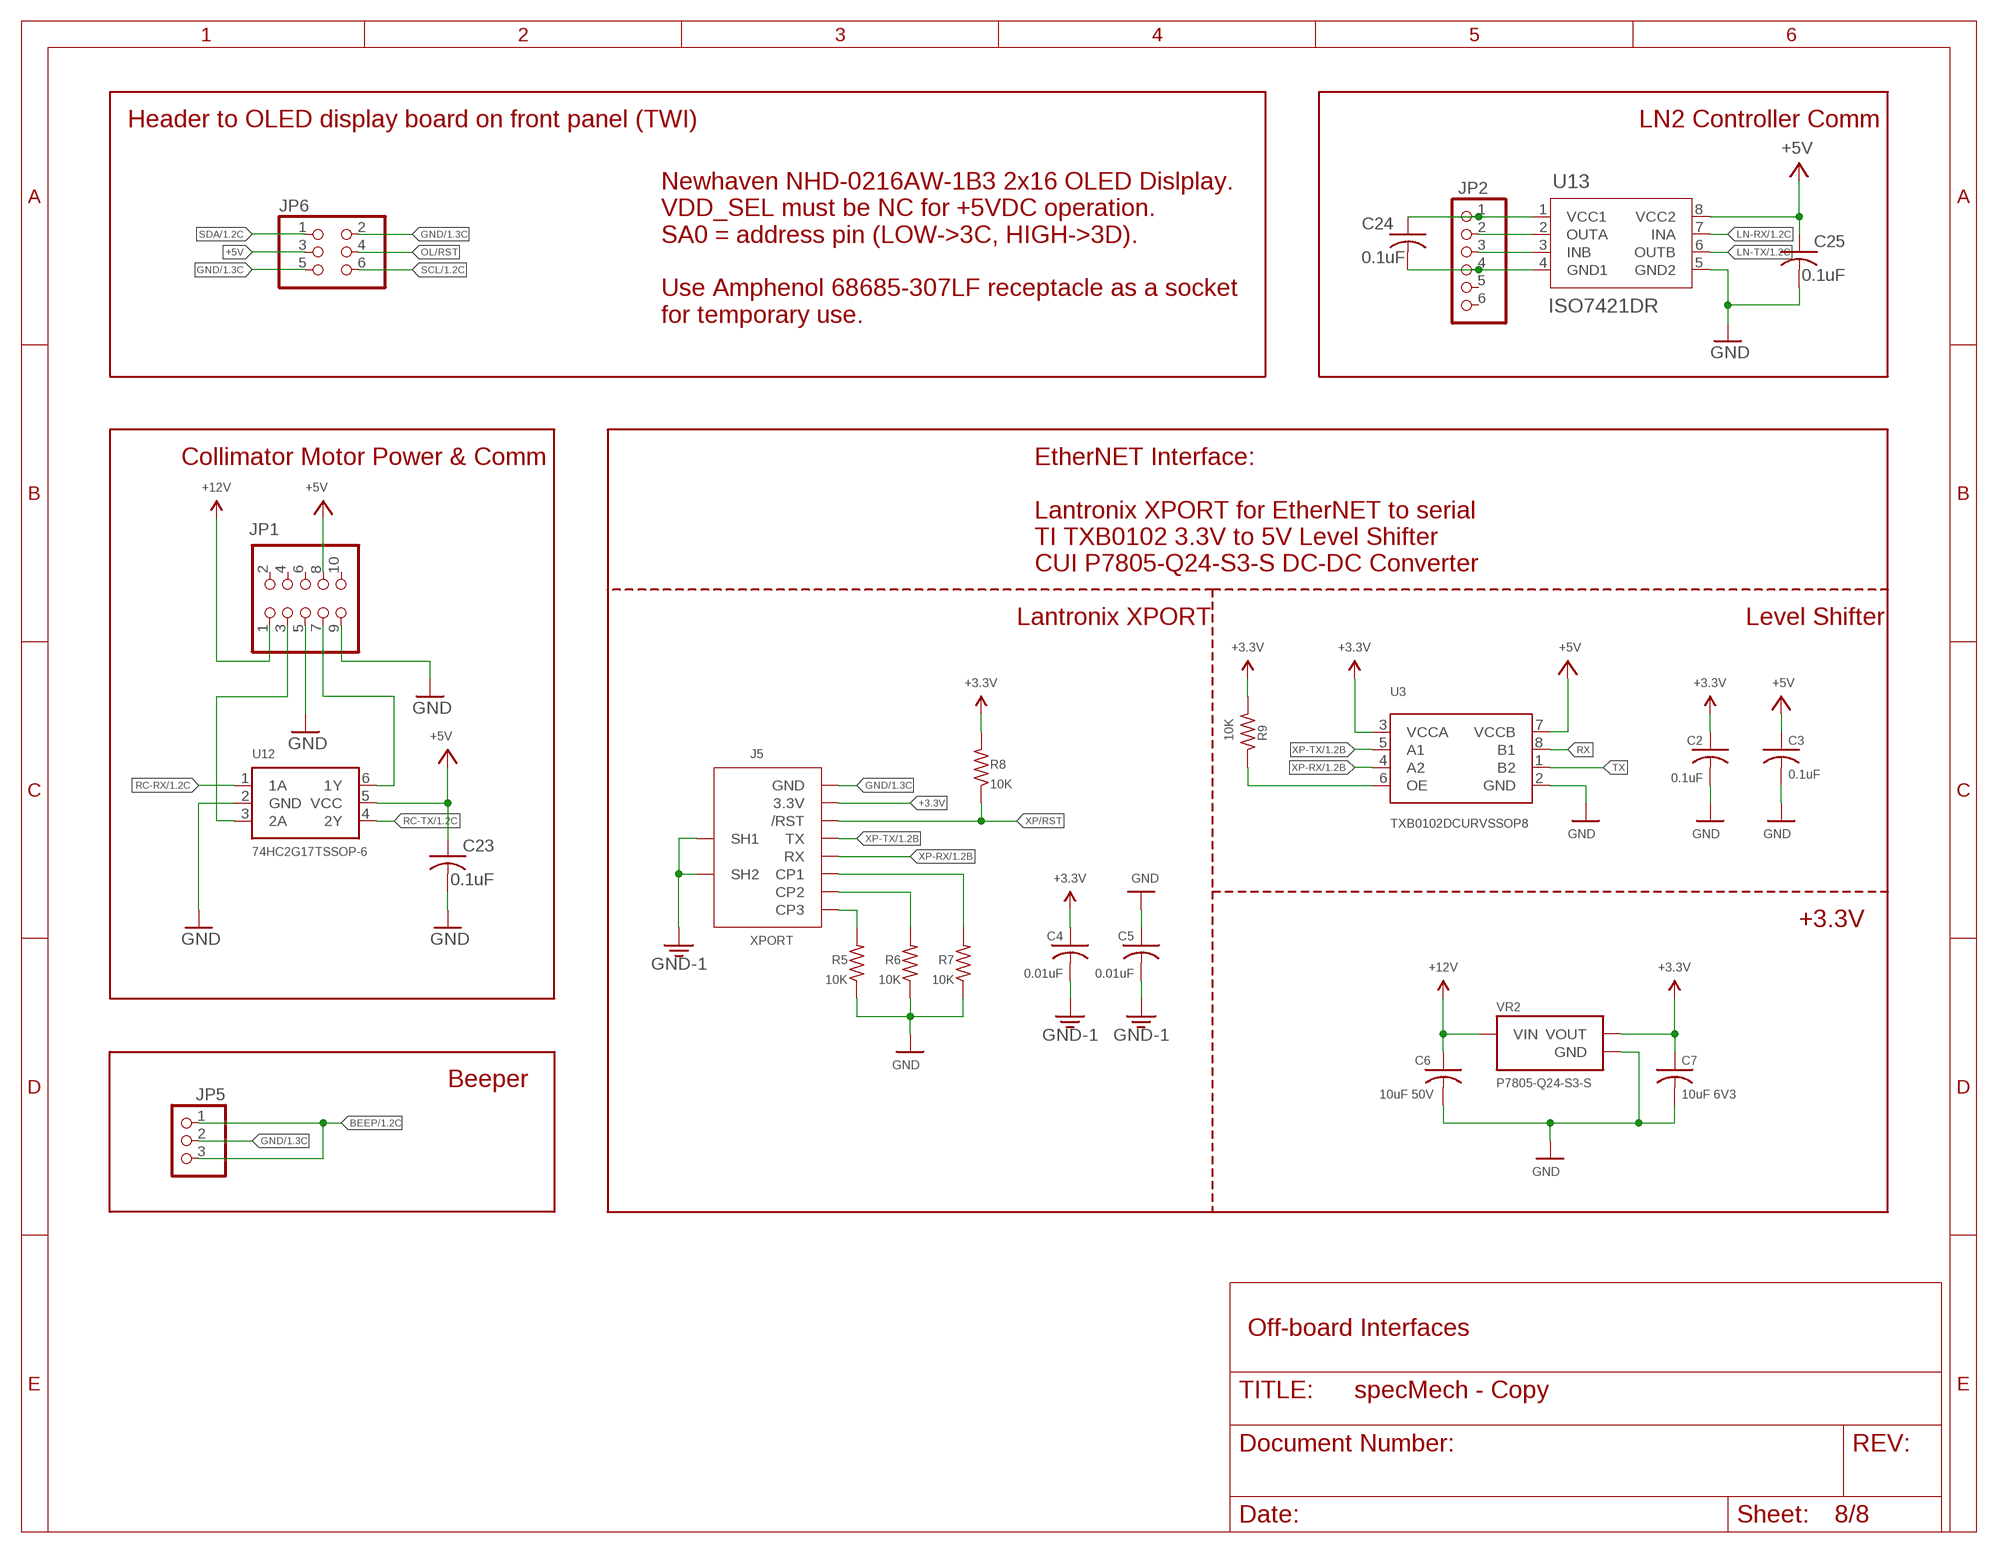
[diagram p7: schematic, sheet 8]

### Parts
C2  0.1uF  C-USC0805  [C0805]
C3  0.1uF  C-USC0805  [C0805]
C4  0.01uF  C-USC0805  [C0805]
C5  0.01uF  C-USC0805  [C0805]
C6  10uF 50V  C-USC1210  [C1210]
C7  10uF 6V3  C-USC0805  [C0805]
C23  0.1uF  C-USC0805  [C0805]
C24  0.1uF  C-USC0805  [C0805]
C25  0.1uF  C-USC0805  [C0805]
J5  XPORT  XPORTXPORT-2  [XPORT-2]
JP1  PINHD-2X5  [2X05]
JP2  PINHD-1X6  [1X06]
JP5  PINHD-1X3  [1X03]
JP6  PINHD-2X3  [2X03]
R5  10K  R-US_R0805  [R0805]
R6  10K  R-US_R0805  [R0805]
R7  10K  R-US_R0805  [R0805]
R8  10K  R-US_R0805  [R0805]
R9  10K  R-US_R0805  [R0805]
U3  TXB0102DCURVSSOP8  [GHI-IC_VSSOP8(TI)]
U12  74HC2G17TSSOP-6  [SOP95P275X110-6]
U13  ISO7421DR  ISO7421DRTI-SOIC-D8  [SOIC127P599X175-8N]
VR2  P7805-Q24-S3-S  [CONV_P7805-Q24-S3-S]

### Nets
3.3V: C7.1 VR2.VOUT ; supply symbol labelled +3.3V
+3.3V: C2.1 C4.1 J5.3.3V R8.2 R9.2 U3.3(VCCA)
+5V: C3.1 C23.1 C25.1 JP1.8 JP6.3 U3.7(VCCB) U12.5(VCC) U13.8(VCC2) ; also sheet 2,3,4,5,6,7
+12V: C6.1 JP1.1 VR2.VIN ; also sheet 2,5
BEEP: JP5.1 JP5.3 ; also sheet 1
CP1: J5.CP1 R7.2
CP2: J5.CP2 R6.2
CP3: J5.CP3 R5.2
GND: C2.2 C3.2 C5.1 C6.2 C7.2 C23.2 C25.2 J5.GND JP1.5 JP1.9 JP5.2 JP6.2 JP6.5 R5.1 R6.1 R7.1 U3.2(GND) U12.2(GND) U13.5(GND2) VR2.GND ; also sheet 1,2,3,4,5,6,7
GND-1: C4.2 C5.2 J5.P$1(SH1) J5.P$2(SH2)
LN-RX: U13.7(INA) ; also sheet 1
LN-TX: U13.6(OUTB) ; also sheet 1
N$8: JP1.3 U12.3(2A)
N$19: JP1.7 U12.6(1Y)
N$23: C24.1 JP2.1 U13.1(VCC1)
N$25: JP2.2 U13.2(OUTA)
N$26: JP2.3 U13.3(INB)
N$27: C24.2 JP2.4 U13.4(GND1)
N$43: R9.1 U3.6(OE)
OL/RST: JP6.4
RC-RX: U12.1(1A) ; also sheet 1
RC-TX: U12.4(2Y) ; also sheet 1
RX: U3.8(B1)
SCL: JP6.6 ; also sheet 1,3,4,5,6,7
SDA: JP6.1 ; also sheet 1,3,4,5,6,7
TX: U3.1(B2)
XP-RX: J5.RX U3.4(A2) ; also sheet 1
XP-TX: J5.TX U3.5(A1) ; also sheet 1
XP/RST: J5./RST R8.1
Unconnected: JP1.2 JP1.4 JP1.6 JP1.10 JP2.5 JP2.6

### Notes on the sheet
- Header to OLED display board on front panel (TWI) | LN2 Controller Comm
- Newhaven NHD-0216AW-1B3 2x16 OLED Dislplay.
  VDD_SEL must be NC for +5VDC operation.
  SA0 = address pin (LOW->3C, HIGH->3D).
  
  Use Amphenol 68685-307LF receptacle as a socket
  for temporary use.
- Collimator Motor Power & Comm
- EtherNET Interface:
  
  Lantronix XPORT for EtherNET to serial
  TI TXB0102 3.3V to 5V Level Shifter
  CUI P7805-Q24-S3-S DC-DC Converter
- Lantronix XPORT | Level Shifter
- +3.3V
- Beeper
- Off-board Interfaces

## Library data of the parts
BT1 = AUmlib:CR2032-BATT-BK-5058: BATTERY HOLDER COIN 20MM PC PIN; DESCRIPTION: Holder Coin Cell Batt Vert Mnt; MF: MPD (Memory; MP: BK-5058; PACKAGE: None; PURCHASE-URL: https://pricing.snapeda.com/search/part/BK-5058/?ref=eda
C1-C27 = AUmlib:C-US: CAPACITOR, American symbol; SPICEPREFIX: C
CNANO1 = AUmlib:CURIOSITYNANO4809
J1-J4 J6-J8 = AUmlib:PINHD-1X8-MOLEX-SHROUD: 8-pin vertical header Molex 0022232081 tin plated version Digikey WM4206-ND $0.50 each 2020-09-15
J5 = AUmlib:XPORT
JP1 = AUmlib:PINHD-2X5: PIN HEADER
JP2 = AUmlib:PINHD-1X6: PIN HEADER
JP3 = AUmlib:PINHD-2X16: PIN HEADER
JP4 = AUmlib:PINHD-1X2: PIN HEADER
JP5 = AUmlib:PINHD-1X3: PIN HEADER
JP6 = AUmlib:PINHD-2X3: PIN HEADER
L1-L3 = AUmlib:MMZ2012Y152BT000: FERRITE BEAD, 1.5 KOHM, 500mA, 0805 , FULL REEL; DESCRIPTION: 1.5 kOhms @ 100MHz 1 Signal Line Ferrite Bead 0805 (2012 Metric) 500mA 400mOhm; MF: TDK; MP: MMZ2012Y152BT000; PACKAGE: 0805 TDK; PURCHASE-URL: https://pricing.snapeda.com/search/part/MMZ2012Y152BT000/?ref=eda
PS1 = AUmlib:OKI-78SR-5/1.5-W36-C: OKI Series 8 W Single Output 5 V Non Isolated Through Hole DC/DC Converter; DESCRIPTION: Linear Regulator Replacement DC DC Converter 1 Output 5V 1.5A 7V - 36V Input; DIGI-KEY_PART_NUMBER: 811-2196-5-ND; MF: Murata Power Solutions Inc.; MP: OKI-78SR-5/1.5-W36-C; PACKAGE: SIP-3 Murata Power; PURCHASE-URL: https://pricing.snapeda.com/search/part/OKI-78SR-5/1.5-W36-C/?ref=eda
R1-R10 R12 R13 R15 R16 R22 R27 = AUmlib:R-US_: RESISTOR, American symbol; SPICEPREFIX: R
R11 R14 = AUmlib:4609X-101-103LF: Resistor array 8X bussed; MANUFACTURER_PART_NUMBER: 4609X101103LF; VENDOR: Bourns Electronics
RN1 RN2 = AUmlib:EXB-38V103JV: Res Thick Film Array 10K Ohm 5% ?200ppm/C ISOL Molded 8-Pin 1206(4 X 0603) Convex SMD Automotive T/R; DESCRIPTION: 10k Ohm ±5% 62.5mW Power Per Element Isolated Resistor Network/Array ±200ppm/°C 1206 (3216 Metric), Convex, Long Side Terminals; DIGI-KEY_PART_NUMBER: Y9103CT-ND; MF: Panasonic; MP: EXB-38V103JV; PACKAGE: 1206 Panasonic; PURCHASE-URL: https://pricing.snapeda.com/search/part/EXB-38V103JV/?ref=eda
U1 U2 U8 U11 = AUmlib:MCP23008-E/SO; BUILT_BY: EMA_UL_Team; MANUFACTURER_PART_NUMBER: MCP23008-E/SO; VENDOR: Microchip
U3 = AUmlib:TXB0102DCUR: Bidirectional voltage level translator. Digikey 296-22862-1-ND $0.71 each 2020-10-19
U4 = AUmlib:MCP9808-E/MS; BUILT_BY: EMA_UL_Team; MANUFACTURER_PART_NUMBER: MCP9808-E/MS; SOURCELIBRARY: Microchip_2014-11-20; VENDOR: Microchip
U5 = AUmlib:TBD62083: Toshiba TBD62083 high current driver, ULN2308 replacement
U6 = AUmlib:DS3231MZ+; BUILT_BY: EMA_UL_Team; MANUFACTURER_PART_NUMBER: DS3231MZ+; VENDOR: Maxim Integrated Products
U7 = AUmlib:LTC4311ISC6TRPBF; BUILT_BY: EMA_UL_Team; MANUFACTURER_PART_NUMBER: ltc4311isc6#trpbf; SOURCELIBRARY: LinearTech_2016_03_08; VENDOR: Linear Technology
U9 U10 = AUmlib:ADS1115IDGSR: ADS1115 16-bit ADC with I2C communications
U12 = AUmlib:74HC2G17: Dual Schmitt Trigger
U13 = AUmlib:ISO7421DR: ISO7421 Dual channel digital isolator.
U14 = AUmlib:MB85RC512: MB85RC512 I2C FRAM
VR2 = AUmlib:P7805-Q24-S3-S: CUI P7805-Q24-S3-S DC-DC Converter 3.3V 2W Digikey 102-2704-ND $4.94 2020-09-14; AVAILABILITY: Good; DESCRIPTION: 3.3V 2W; MF: CUI; MP: P7805-Q12-S1R5-S; PACKAGE: SIP-3 CUI; PRICE: $4.94